# EAGLE design PowerRailBoard (EAGLE 7.7.0)
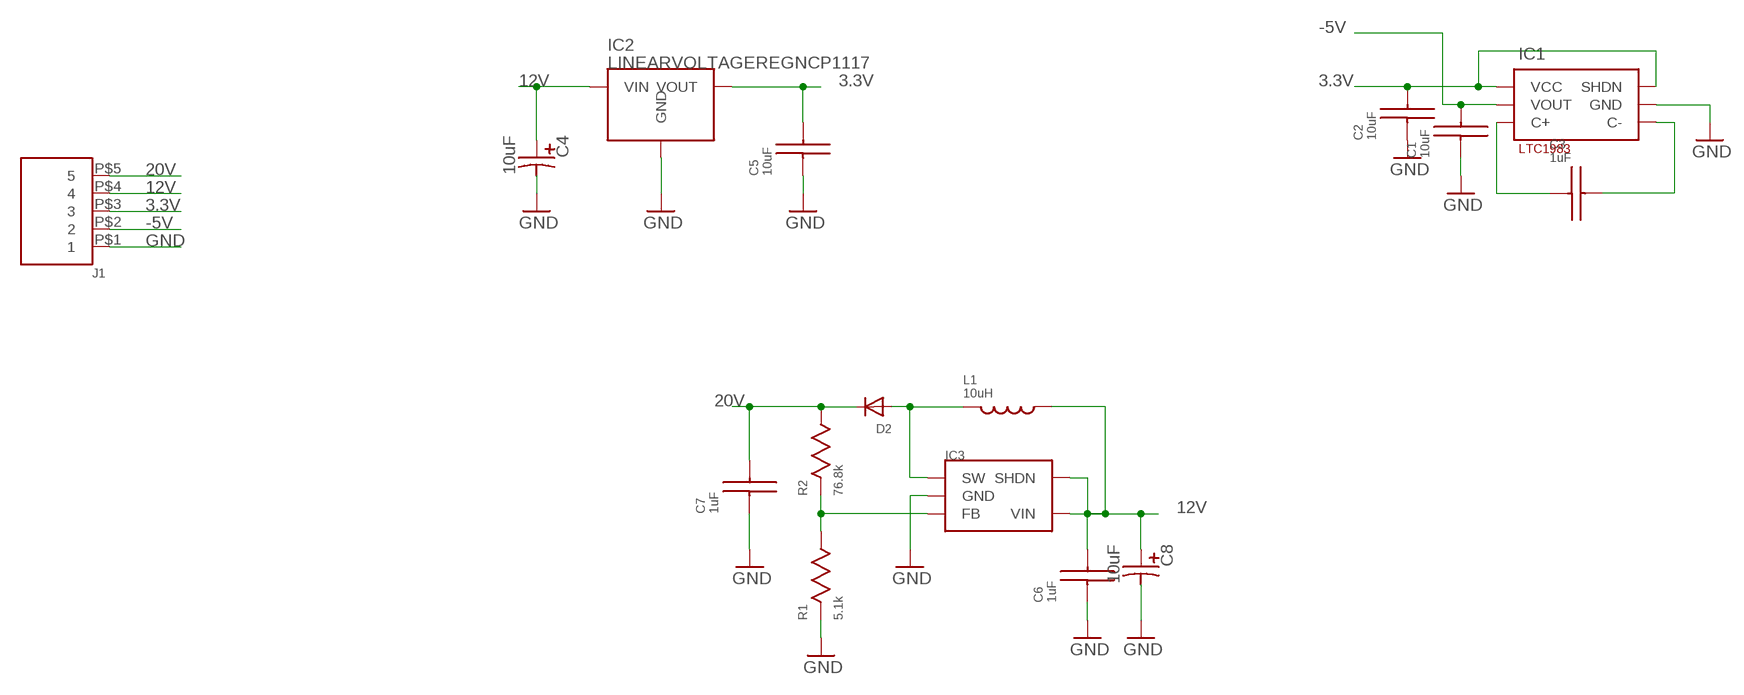
[diagram p0: schematic, sheet 1]

## Parts
C1  10uF  CHIP_CAP0805  [0805_(2012_METRIC)]
C2  10uF  CHIP_CAP0805  [0805_(2012_METRIC)]
C3  1uF  CHIP_CAP0805  [0805_(2012_METRIC)]
C4  10uF  CHIP_CAP_POLB  [CAP_SSER_5MMX5MM]
C5  10uF  CHIP_CAP0805  [0805_(2012_METRIC)]
C6  1uF  CHIP_CAP0805  [0805_(2012_METRIC)]
C7  1uF  CHIP_CAP0805  [0805_(2012_METRIC)]
C8  10uF  CHIP_CAP_POLB  [CAP_SSER_5MMX5MM]
D2  DIODESOD-123  [SOD-123]
IC1  LTC1983  [TSOT23-6]
IC2  LINEARVOLTAGEREGNCP1117  [DPAK]
IC3  AP301  [SOT-23]
J1  CONNECTOR_5PIN  [5PIN_.1']
L1  10uH  CHIP_IND  [0805_(2012_METRIC)]
R1  5.1k  CHIP_RES0805  [0805_(2012_METRIC)]
R2  76.8k  CHIP_RES0805  [0805_(2012_METRIC)]

## Nets
3.3V: C2.P$1 C5.P$1 IC1.1(VCC) IC1.6(SHDN) IC2.2(VOUT) J1.P$3
12V: C4.P(POSITIVE) C6.P$1 C8.P(POSITIVE) IC2.3(VIN) IC3.4(SHDN) IC3.5(VIN) J1.P$4 L1.P$2
20V: C7.P$1 D2.C J1.P$5 R2.P$1
-5V: C1.P$1 IC1.2(VOUT) J1.P$2
GND: C1.P$2 C2.P$2 C4.N(NEGATIVE) C5.P$2 C6.P$2 C7.P$2 C8.N(NEGATIVE) IC1.5(GND) IC2.1(GND) IC3.2(GND) J1.P$1 R1.P$2
N$1: C3.P$2 IC1.3(C+)
N$2: C3.P$1 IC1.4(C-)
N$3: D2.A IC3.1(SW) L1.P$1
N$5: IC3.3(FB) R1.P$1 R2.P$2

## Library data of the parts
C1-C3 C5-C7 = lolomolo:CHIP_CAP
C4 C8 = lolomolo:CHIP_CAP_POL
D2 = adafruit:DIODE: Diode SMADIODE - SMA Surface Mount Package 20V 1A Schottky Diode Digikey: 641-1014-6-ND DO-1N4148 - Through Hole Small Current Diode SOD-123 20V 1 A (.5mV Vf) Schottky Diode - Digikey: MBRX120TPMSCT-ND SOD-323 10V 570mA (.38mV Vf, 3ns) Schottky Diode - Digikey: ZLLS410CT-ND SOD-523 30V 30mA Schottky Diode (RB751S-40TE61) - Digikey: RB751S-40TE61CT-ND SOT23-R/W - SOT23 Package (R = Solder Paste/Reflow Ovens, W = Hand-Soldering) BAT54Film 40V 300mA - Digikey: 497-7162-1-ND
IC1 = lolomolo:LTC1983
IC2 = lolomolo:LINEARVOLTAGEREG
IC3 = lolomolo:AP301
J1 = lolomolo:CONNECTOR_5PIN
L1 = lolomolo:CHIP_IND: Chip Inductor
R1 R2 = lolomolo:CHIP_RES

## Board
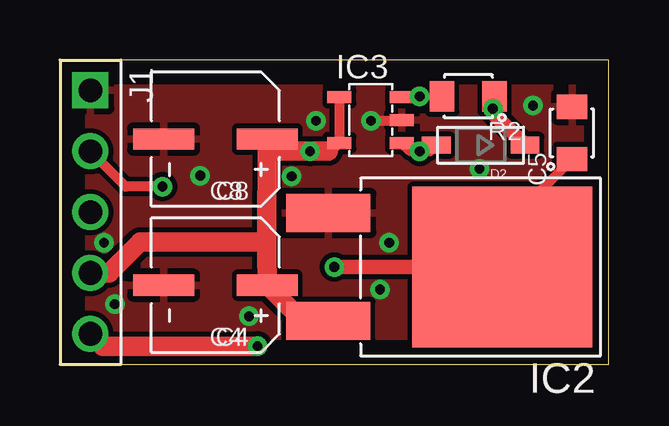
[diagram p1: board, top side]
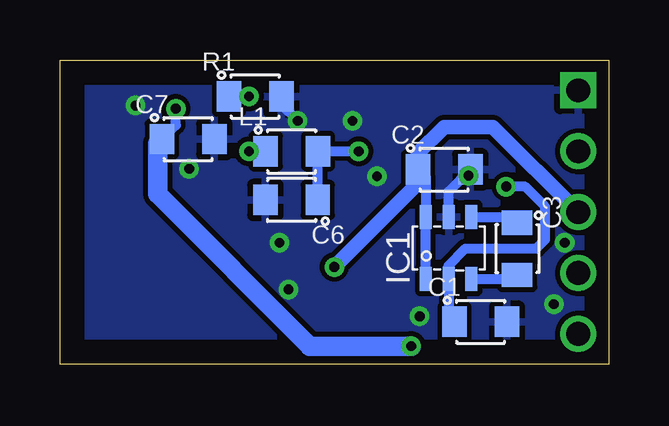
[diagram p2: board, bottom side, seen from below]

Size 22.86 x 12.7 mm. Coordinates in mm from the lower left corner, seen from the top.
Outline: 0,0 22.86,0 22.86,12.7 0,12.7 0,0
Copper layers (1*16): Top 0.035mm / dielectric 1.5mm / Bottom 0.035mm
Design rules "default": minimum track width 10mil, minimum drill 24mil, track to track 8mil, track to pad 8mil, pad to pad 8mil, via to via 8mil, smd to smd 8mil, copper to edge 40mil, drill to drill 8mil, minimum pad ring 10mil, minimum via ring 8mil, stop-mask expansion 4mil, vias tented up to drill 0mil, thermal gap 10mil

### Footprints (pad centres in the part's own frame; a part is rotated, then mirrored left to right if it is on the bottom)
0805_(2012_METRIC) = smd 1.016 x 1.27: P$1 -1.087,0; P$2 1.097,0
CAP_SSER_5MMX5MM = smd 0.889 x 2.54: N 2.794,-0.508; P 2.794,-4.826
SOD-123 = smd 1.2 x 0.7: A 1.85,0; C -1.85,0
TSOT23-6 = smd 1 x 0.5: 1 -1.27,1.27; 2 -1.27,0.32; 3 -1.27,-0.63; 4 1.33,-0.63; 5 1.33,0.32; 6 1.33,1.27
DPAK = smd 3.5 x 1.6: 1 0.25,-2.25; 3 0.25,2.25 | smd 7.5 x 6.7: 2 -7,0
SOT-23 = smd 1 x 0.5: 1 1.29,-0.92; 2 1.29,0.03; 3 1.29,0.98; 4 -1.31,0.98; 5 -1.31,-0.92
5PIN_.1' = drill 0.991 square: P$1 -5.08,0 | drill 0.991: P$2 -2.54,0; P$3 0,0; P$4 2.54,0; P$5 5.08,0

### Placement (x,y rotation side)
C1  5.33,1.78 0 bottom
C2  6.86,8.13 0 bottom
C3  3.81,4.83 270 bottom
C4  3.81,0.51 90 top
C5  21.34,9.65 90 top
C6  13.21,6.86 180 bottom
C7  17.53,9.4 0 bottom
C8  3.81,6.6 90 top
D2  17.53,9.14 180 top
IC1  6.35,4.83 90 bottom
IC2  11.43,4.06 180 top
IC3  12.95,10.16 0 top
J1  1.27,6.35 270 top
L1  13.21,8.89 0 bottom
R1  14.73,11.18 0 bottom
R2  17.02,11.18 180 top

### Tracks (layer width: path | path; a pad name or v marks a point on that pad's centre or on a via)
3.3V  (via drill 0.41)
  Top 0.406: C5.P$1 18.29,5.52 18.29,4.57 18.43,4.43 IC2.2
  Top 0.61: 18.29,5.52 17.78,5.01 17.78,4.32 17.53,4.06 v11.43,4.06
  Bottom 0.406: C2.P$1 7.62,7.8 IC1.6 IC1.1
  Bottom 0.61: J1.P$3 4.83,9.91 6.86,9.91 7.95,8.82 C2.P$1 7.95,7.55 v11.43,4.06
12V  (via drill 0.41)
  Top 0.406: IC3.4 IC3.5 11.29,8.89 11.18,8.89 v10.41,8.89
  Top 0.813: 8.62,5.1 C8.P 9.14,8.89 11.18,8.89 | 8.62,5.1 8.61,4.72 C4.P 10.12,1.81 IC2.3 | J1.P$4 2.06,3.81 3.35,5.1 8.62,5.1
  Bottom 0.406: v10.41,8.89 L1.P$2 C6.P$1
20V  (via drill 0.41)
  Top 0.406: v18.03,10.67 18.11,10.74 R2.P$1
  Top 0.61: D2.C 18.03,10.49 v18.03,10.67
  Top 0.813: J1.P$5 1.78,0.76 v8.23,0.76
  Bottom 0.406: C7.P$1 18.03,9.98 v18.03,10.67
  Bottom 0.813: C7.P$1 18.8,9.21 18.8,7.11 12.45,0.76 v8.23,0.76
-5V  (via drill 0.41)
  Top 0.406: v4.27,7.42 2.74,7.42 J1.P$2
  Bottom 0.406: C1.P$1 6.67,2.03 IC1.2 6.68,4.12 5.97,4.83 3.02,4.83 2.64,5.21 2.64,6.58 3.48,7.42 v4.27,7.42
GND  (via drill 0.41)
  Top 0.406: v12.95,10.16 14.21,10.16 IC3.2
  Bottom 0.406: R1.P$2 13.63,10.84 v12.95,10.16 | IC1.5 6.67,7.22 C2.P$2
  other vias: 10.67,10.16 5.84,7.87 13.72,5.08 13.34,3.12 2.29,2.51 19.71,10.79 17.48,8.15 9.65,7.85 7.87,2.01 1.83,5.08
  pour Top: 0,12.7 22.86,12.7 22.86,0 0,0
  pour Bottom: 0,12.7 22.86,12.7 22.86,0 0,0
N$1
  Bottom 0.406: IC1.3 3.98,3.56 C3.P$2
N$2
  Bottom 0.406: IC1.4 4.05,6.16 C3.P$1
N$3  (via drill 0.41)
  Top 0.406: IC3.1 14.59,8.89 v14.99,8.89 15.42,8.89 D2.A
  Bottom 0.406: L1.P$1 v14.99,8.89
N$5  (via drill 0.41)
  Top 0.305: IC3.3 14.28,11.18 v14.99,11.18 R2.P$2
  Bottom 0.305: R1.P$1 v14.99,11.18